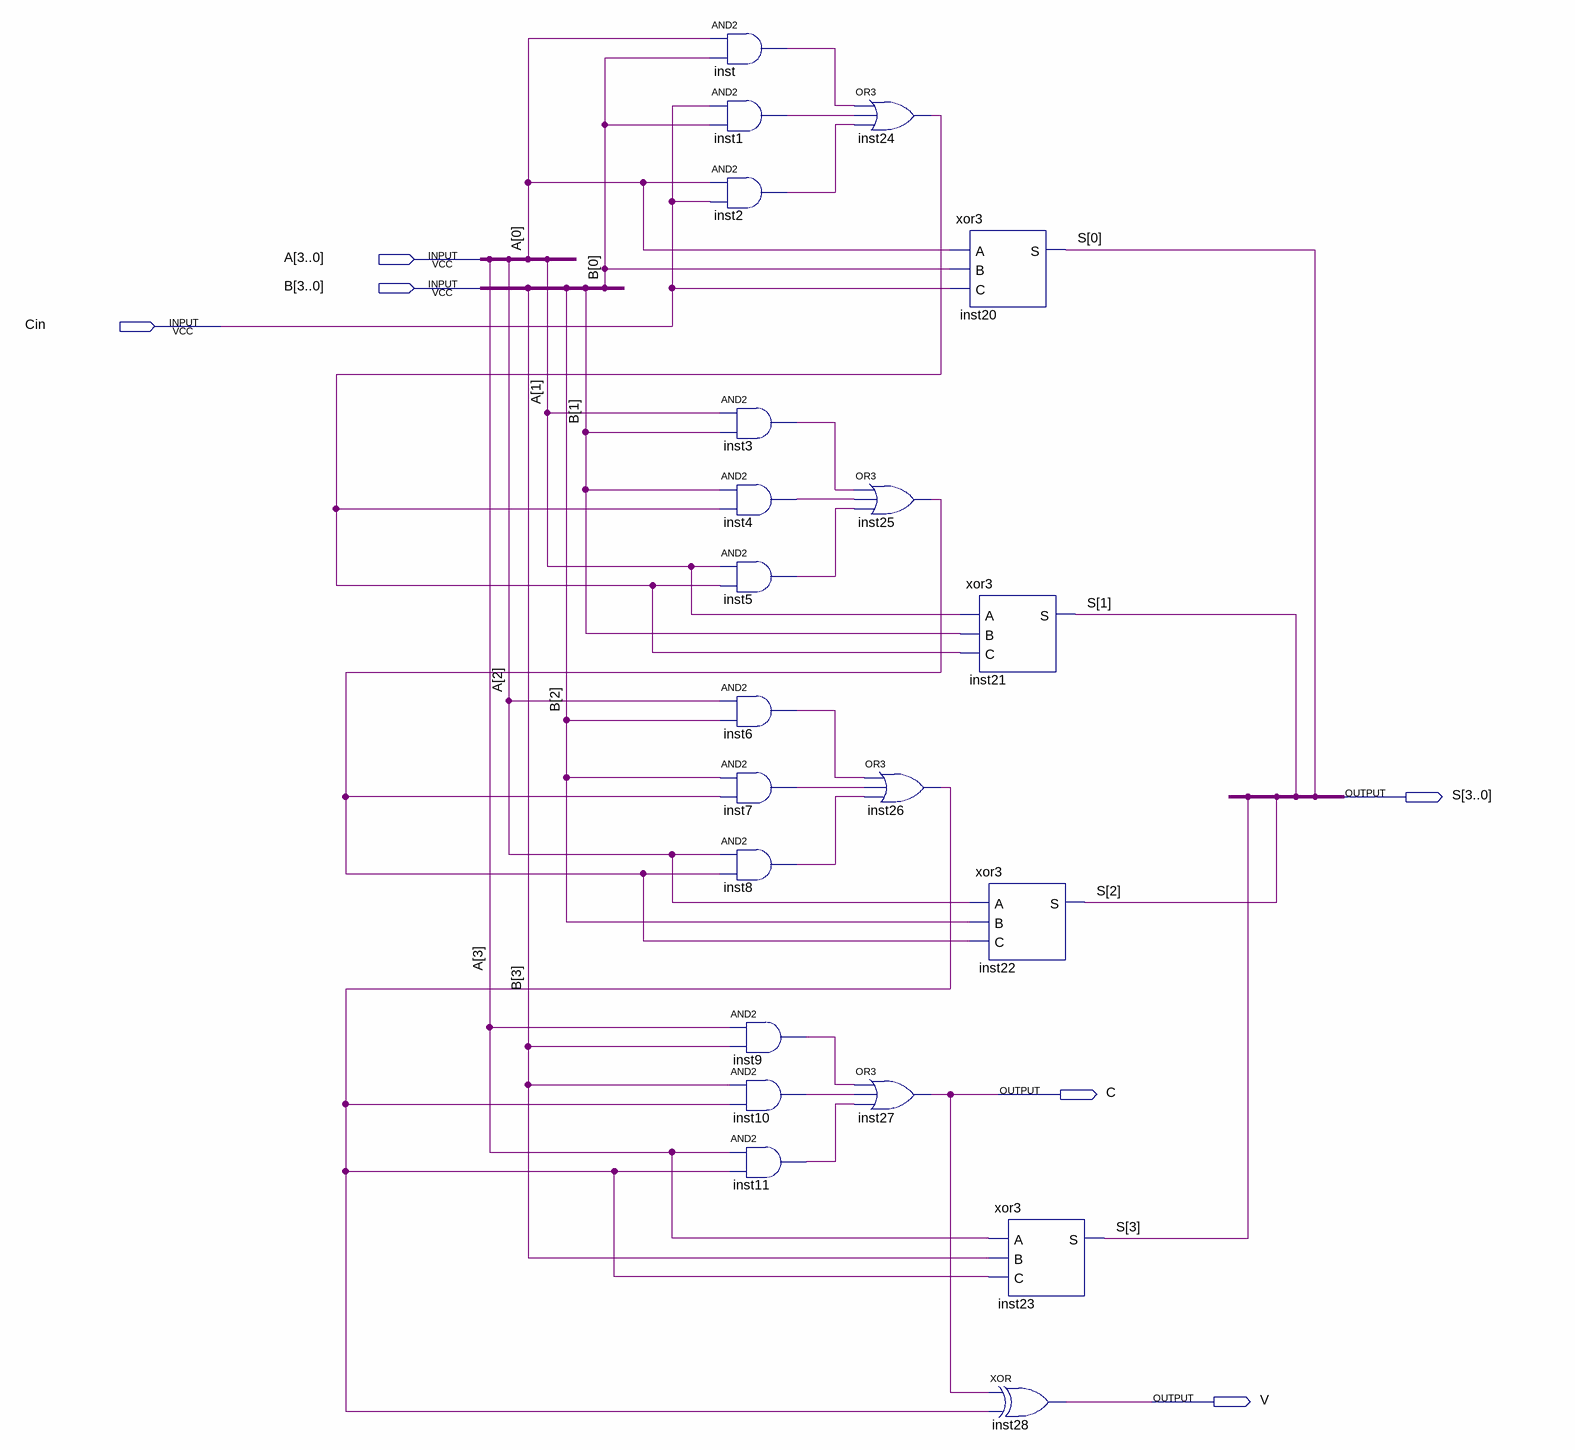
[diagram p0: schematic sheet]
// Quartus schematic Sumador4Bits.bdf as structural Verilog: 21 symbols, 6 pins
module Sumador4Bits (
  input  [3:0] A,
  input  [3:0] B,
  input  Cin,
  output [3:0] S,
  output C,
  output V
);

  wire inst1_out, inst2_out, inst3_out, inst4_out, inst5_out, inst6_out, inst7_out, inst8_out, inst9_out,
       inst10_out, inst11_out, inst24_out, inst25_out, inst26_out, inst_out;

  and inst (inst_out, A[0], B[0]);
  and inst1 (inst1_out, Cin, B[0]);
  and inst2 (inst2_out, A[0], Cin);
  and inst3 (inst3_out, A[1], B[1]);
  and inst4 (inst4_out, B[1], inst24_out);
  and inst5 (inst5_out, A[1], inst24_out);
  and inst6 (inst6_out, A[2], B[2]);
  and inst7 (inst7_out, B[2], inst25_out);
  and inst8 (inst8_out, A[2], inst25_out);
  and inst9 (inst9_out, A[3], B[3]);
  and inst10 (inst10_out, B[3], inst26_out);
  and inst11 (inst11_out, A[3], inst26_out);
  or inst24 (inst24_out, inst_out, inst1_out, inst2_out);
  or inst25 (inst25_out, inst3_out, inst4_out, inst5_out);
  or inst26 (inst26_out, inst6_out, inst7_out, inst8_out);
  or inst27 (C, inst9_out, inst10_out, inst11_out);
  xor3 inst20 (.A(A[0]), .B(B[0]), .C(Cin), .S(S[0]));
  xor3 inst21 (.A(A[1]), .B(B[1]), .C(inst24_out), .S(S[1]));
  xor3 inst22 (.A(A[2]), .B(B[2]), .C(inst25_out), .S(S[2]));
  xor3 inst23 (.A(A[3]), .B(B[3]), .C(inst26_out), .S(S[3]));
  xor inst28 (V, C, inst26_out);
endmodule
